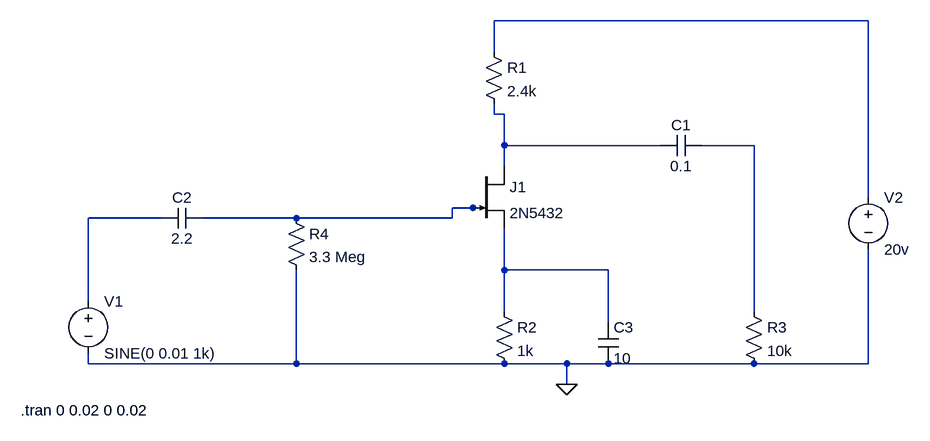
[diagram p0: schematic AC 7.asc]
AC 7.asc, the LTspice schematic file:
Version 4
SHEET 1 888 680
WIRE 816 -272 240 -272
WIRE 240 -224 240 -272
WIRE 240 -128 240 -144
WIRE 256 -128 240 -128
WIRE 256 -80 256 -128
WIRE 496 -80 256 -80
WIRE 640 -80 560 -80
WIRE 256 -48 256 -80
WIRE 816 0 816 -272
WIRE 208 16 176 16
WIRE 224 16 208 16
WIRE -272 32 -384 32
WIRE -64 32 -208 32
WIRE 176 32 176 16
WIRE 176 32 -64 32
WIRE 256 112 256 48
WIRE 416 112 256 112
WIRE -384 160 -384 32
WIRE 256 176 256 112
WIRE 640 176 640 -80
WIRE 416 192 416 112
WIRE -384 256 -384 240
WIRE -64 256 -64 112
WIRE -64 256 -384 256
WIRE 256 256 -64 256
WIRE 352 256 256 256
WIRE 416 256 352 256
WIRE 640 256 416 256
WIRE 816 256 816 80
WIRE 816 256 640 256
WIRE 352 288 352 256
FLAG 352 288 0
SYMBOL res 224 -240 R0
SYMATTR InstName R1
SYMATTR Value 2.4k
SYMBOL res 240 160 R0
SYMATTR InstName R2
SYMATTR Value 1k
SYMBOL res 624 160 R0
SYMATTR InstName R3
SYMATTR Value 10k
SYMBOL res -80 16 R0
SYMATTR InstName R4
SYMATTR Value 3.3 Meg
SYMBOL cap 560 -96 R90
WINDOW 0 0 32 VBottom 2
WINDOW 3 32 32 VTop 2
SYMATTR InstName C1
SYMATTR Value 0.1
SYMBOL cap -208 16 R90
WINDOW 0 0 32 VBottom 2
WINDOW 3 32 32 VTop 2
SYMATTR InstName C2
SYMATTR Value 2.2
SYMBOL cap 400 192 R0
SYMATTR InstName C3
SYMATTR Value 10
SYMBOL voltage -384 144 R0
SYMATTR InstName V1
SYMATTR Value SINE(0 0.01 1k)
SYMBOL njf 208 -48 R0
SYMATTR InstName J1
SYMATTR Value 2N5432
SYMBOL voltage 816 -16 R0
SYMATTR InstName V2
SYMATTR Value 20v
TEXT -488 328 Left 2 !.tran 0 0.02 0 0.02

The netlist it stands for:
* AC 7.asc
R1 N001 N002 2.4k
R2 N006 0 1k
R3 N003 0 10k
R4 N004 0 3.3 Meg
C1 N003 N002 0.1
C2 N004 N005 2.2
C3 N006 0 10
V1 N005 0 SINE(0 0.01 1k)
J1 N002 N004 N006 2N5432
V2 N001 0 20v
.model NJF NJF
.model PJF PJF
.lib standard.jft
.tran 0 0.02 0 0.02
.backanno
.end